# Altium project CanSat Payload.PrjPcb
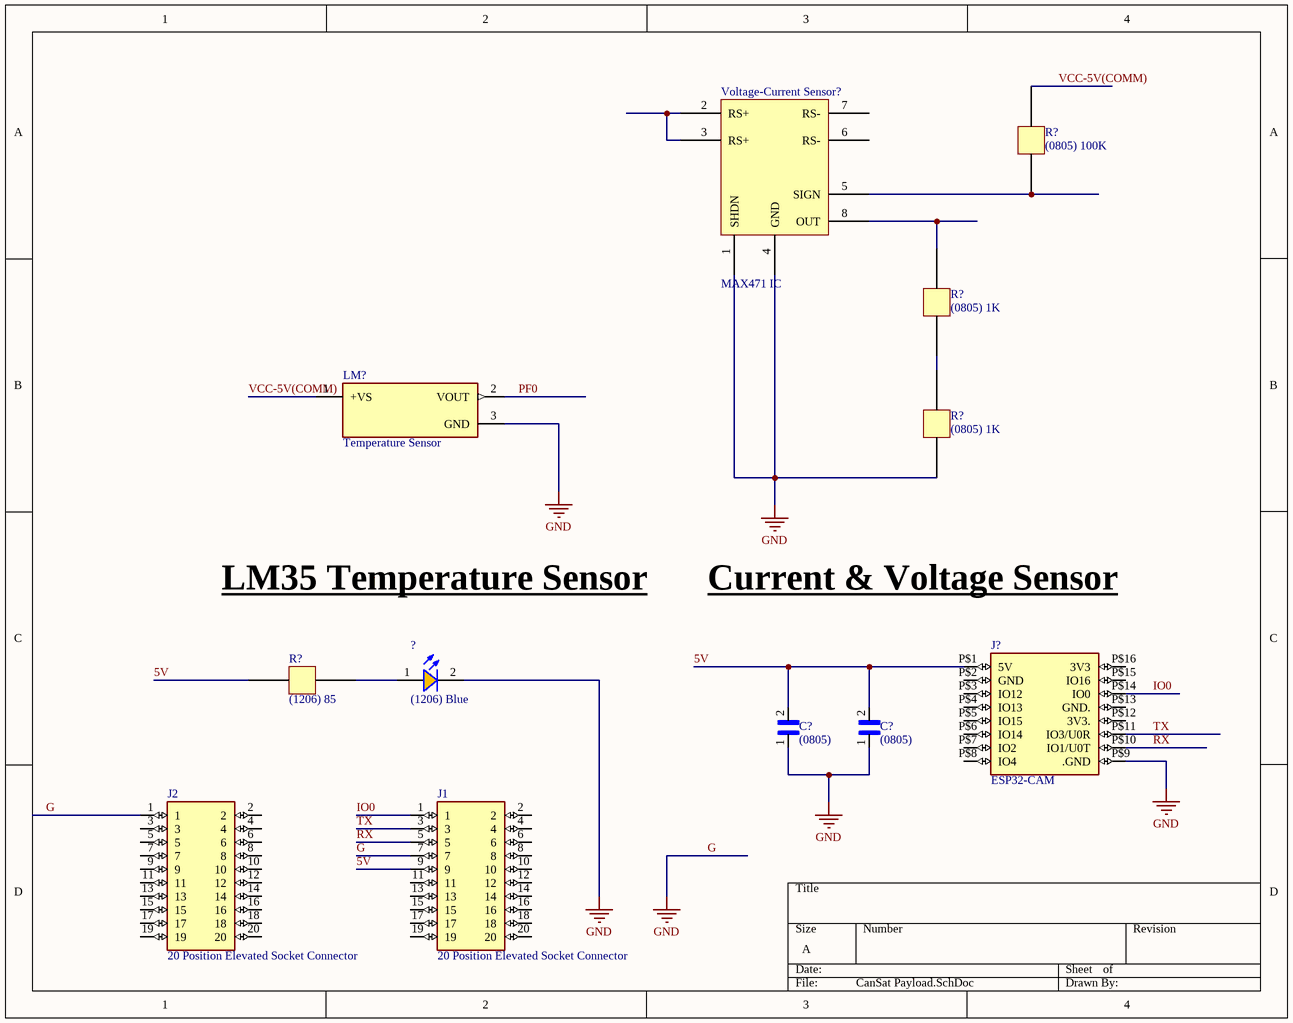
[diagram p0: CanSat Payload.SchDoc]
1 sheet, 12 parts. Net scope: global (net labels, ports and power ports of the same name join across sheets).
Board file: CanSat Payload.PcbDoc

## Sheet CanSat Payload.SchDoc
size A; SheetNumber: 1; SheetTotal: 1

### Parts
(Parts that share a designator on the sheet are numbered #1, #2 ... from top to bottom, then left to right.)
?  (1206) Blue  [RESC3015X65-01]
C?#1  (0805)  [CAPC2012X95N-0]
C?#2  (0805)  [CAPC2012X95N-0]
CAM  ESP32-CAM  [ESP32-CAM]
J1  20 Position Elevated Socket Connector  [ESQ-110-XX-X-D]
J2  20 Position Elevated Socket Connector  [ESQ-110-XX-X-D]
LM?  Temperature Sensor  [TO92127P521H735-4]
R?#1  (0805) 100K  [CAPC2012X95N-0]
R?#2  (0805) 1K  [CAPC2012X95N-0]
R?#3  (0805) 1K  [CAPC2012X95N-0]
R?#4  (1206) 85  [CAPC3216X125N0]
Voltage-Current_Sensor?  MAX471 IC  [SOIC127P600X168-8N]

### Nets
G: ?.2(K) C?#1.1 C?#2.1 CAM.P$9(.GND) J1.7 J2.1 LM?.3(GND) R?#3.1 Voltage-Current_Sensor?.1(SHDN) Voltage-Current_Sensor?.4(GND)  [also labelled GND]
5V: C?#1.2 C?#2.2 CAM.P$1(5V) J1.9 R?#4.1
IO0: CAM.P$14(IO0) J1.1
PF0: LM?.2(VOUT)
RX: CAM.P$10(IO1/U0T) J1.5
TX: CAM.P$11(IO3/U0R) J1.3
VCC-5V(COMM): LM?.1(+VS) R?#1.2
Net?_1: ?.1(A) R?#4.2
NetR?#1_1: R?#1.1 Voltage-Current_Sensor?.5(SIGN)
NetR?#2_1: R?#2.1 R?#3.2
NetR?#2_2: R?#2.2 Voltage-Current_Sensor?.8(OUT)
NetVoltage-Current_Sensor?_2: Voltage-Current_Sensor?.2(RS+) Voltage-Current_Sensor?.3(RS+)

Not connected (* = marked no-connect by the designer): CAM P$2(GND) P$3(IO12) P$4(IO13) P$5(IO15) P$6(IO14) P$7(IO2) P$8(IO4) P$12(3V3.) P$13(GND.) P$15(IO16) P$16(3V3); J1 2 4 6 8 10 11 12 13 14 15 16 17 18 19 20; J2 2 3 4 5 6 7 8 9 10 11 12 13 14 15 16 17 18 19 20; Voltage-Current_Sensor? 6(RS-) 7(RS-)

### Notes on the sheet
- LM35 Temperature Sensor
- Current & Voltage Sensor

### Library data of the parts
? = LED 1206: LED SMD 1206 High Quality Forward Voltage: 3.2 V / Brightness: 700 mcd; Manufacturer: Wurth Elektronik; Manufacturer Part Number: 150060AS75003; Chip Technology: AlInGaP; Dominant Wavelength: 605nm; Emitting Color: Amber; Forward Voltage: 2V; Luminous Intensity: 350mcd; Peak Wavelength: 610nm; Viewing Angle: 140°; ComponentLink1Description: Manufacturer Link; ComponentLink1URL: http://www.we-online.de; ComponentLink2Description: Datasheet; ComponentLink2URL: https://www.we-online.com/catalog/datasheet/150060AS75003.pdf; Height: 0.7mm; Length: 1.6mm; Mounting Technology: SMT; Operating Temperature max.: 100C; Operating Temperature min.: -40C; Packaging: Tape and Reel; Size: 0603; Width: 0.8mm
C?#1 C?#2 = Capacitor 0805: UMK212SD103KD-T/CAP CER 10000PF 50V 0805; Package: None; Price: None; Value: *; MP: UMK212SD103KD-T; Availability: Unavailable
CAM = ESP32-CAM: The smallest 802.11b/g/n Wi-Fi BT SoC Module; MF: AI-Thinker
J1 J2 = 20 Position Elevated Socket Connector: 20 Position Elevated Socket Connector Through Hole; MP: ESQ-110-14-T-D; MF: Samtec; Package: None; SnapEDA_Link: https://www.snapeda.com/parts/ESQ-110-14-T-D/Samtec%20Inc./view-part/786056/?ref=snap; Value: *; Availability: Unavailable; Price: None
LM? = LM35DZ/NOPB/Temperature Sensor: LM35DZ/NOPB/Temperature Sensor Analog, Local 0Â°C ~ 100Â°C 10mV/Â°C TO-92-3; MF: Texas Instruments; MP: LM35DZ; Value: *; SnapEDA_Link: https://www.snapeda.com/parts/LM35DZ/Texas+Instruments/view-part/?ref=snap; Price: None; Availability: Not in stock; Package: E-PKG AXIAL-LEADED-2 ON Semiconductor; Check_prices: https://www.snapeda.com/parts/LM35DZ/Texas+Instruments/view-part/?ref=eda
R?#1-R?#3 = Resistor 0805
R?#4 = Resistor 1206